# Altium schematic sheet Sheet1.SchDoc
size A2
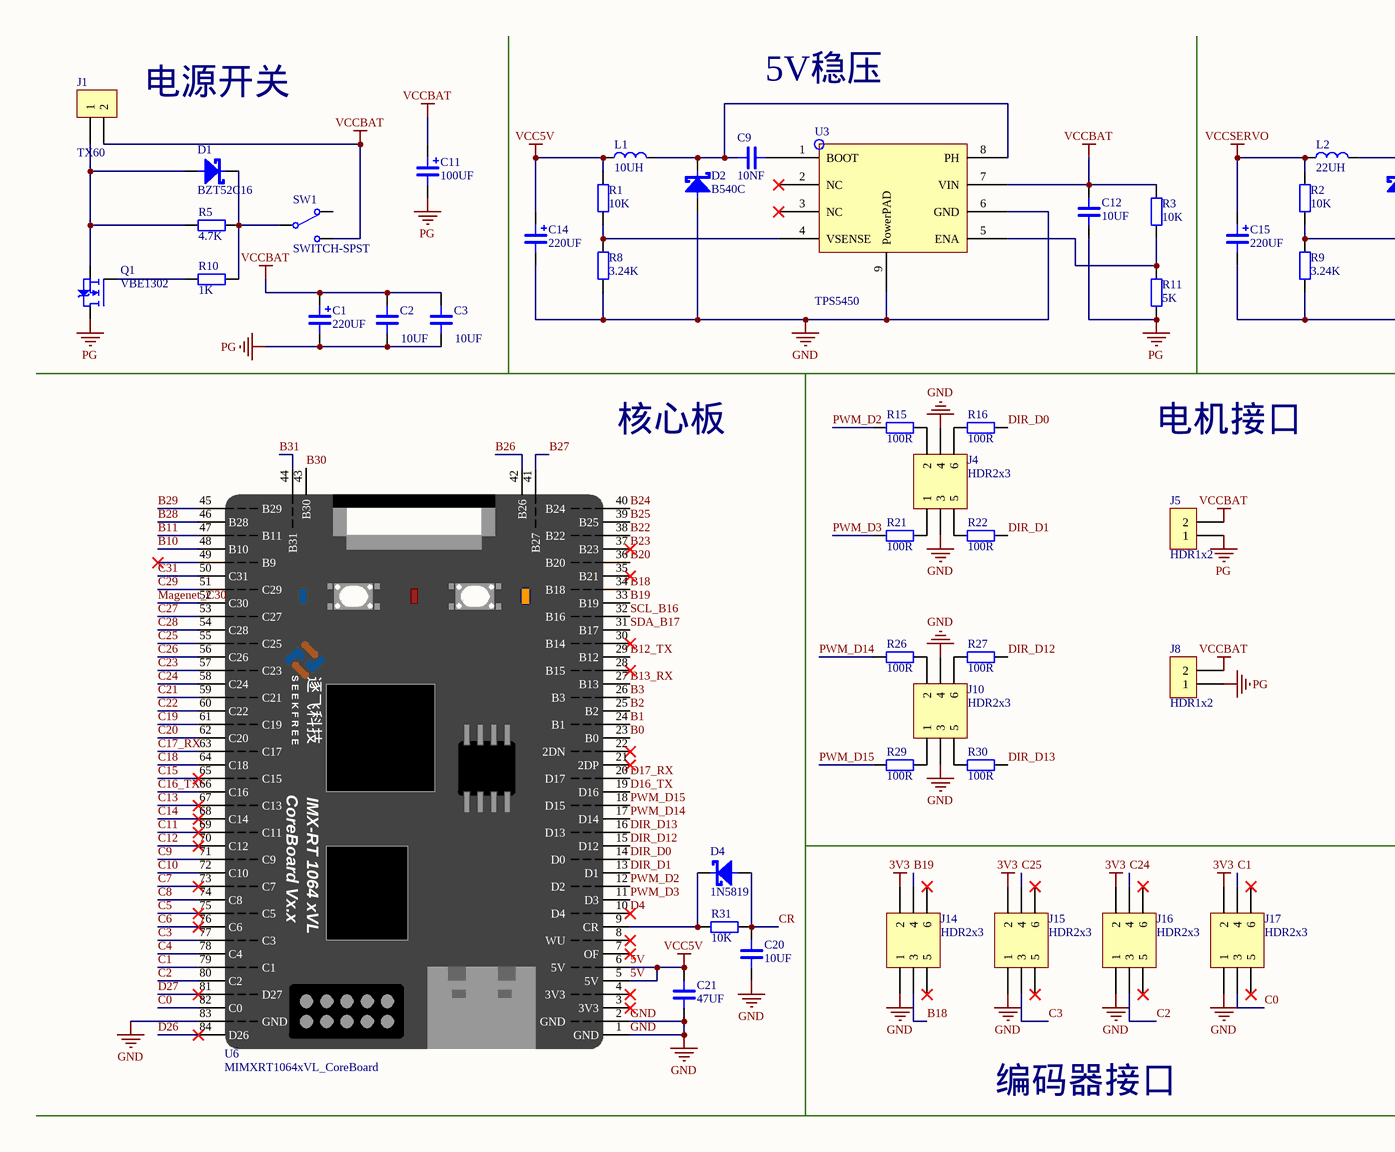
[diagram p0: Sheet1.SchDoc, left]
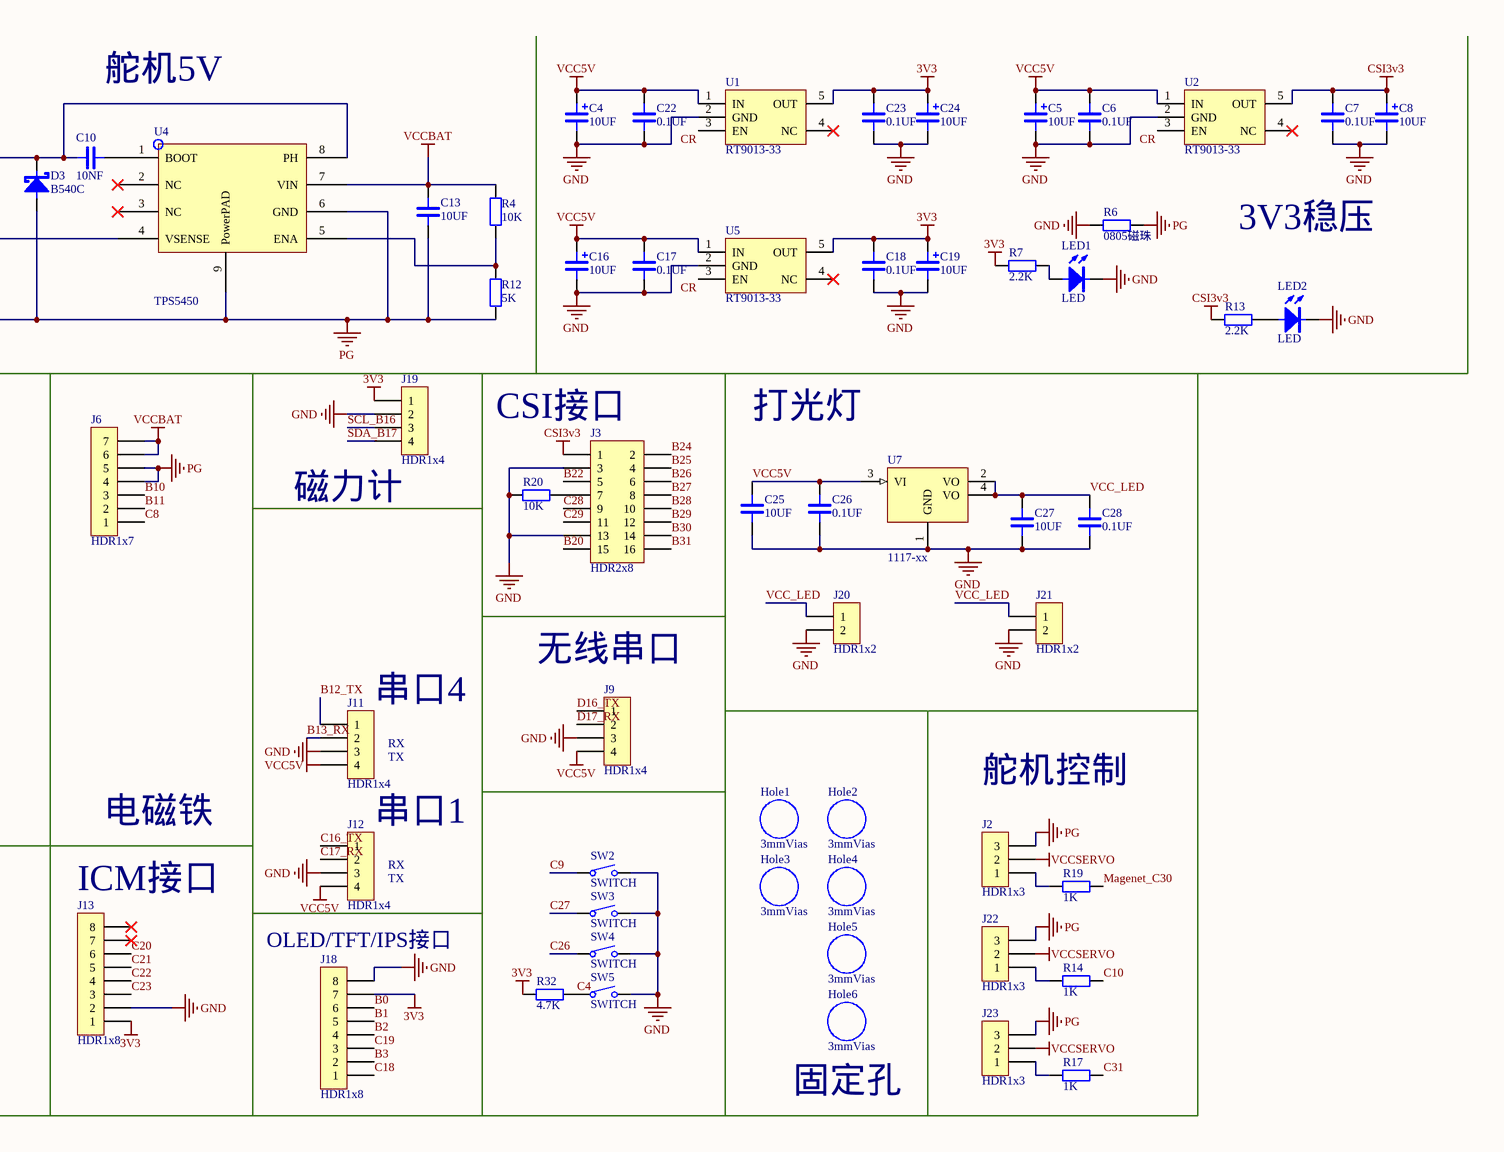
[diagram p1: Sheet1.SchDoc, right]

## Parts
C1  220UF  [DIP-EC3.5X8X11.5]
C2  10UF  [0603]
C3  10UF  [0603]
C4  10UF  [106]
C5  10UF  [106]
C6  0.1UF  [0603]
C7  0.1UF  [0603]
C8  10UF  [106]
C9  10NF  [0603]
C10  10NF  [0603]
C11  100UF  [DIP-EC2.5X6.3X11.2]
C12  10UF  [0603]
C13  10UF  [0603]
C14  220UF  [DIP-EC3.5X8X11.5]
C15  220UF  [DIP-EC3.5X8X11.5]
C16  10UF  [106]
C17  0.1UF  [0603]
C18  0.1UF  [0603]
C19  10UF  [106]
C20  10UF  [0603]
C21  47UF  [1206]
C22  0.1UF  [0603]
C23  0.1UF  [0603]
C24  10UF  [106]
C25  10UF  [0603]
C26  0.1UF  [0603]
C27  10UF  [0603]
C28  0.1UF  [0603]
D1  BZT52C16  [SOD-123]
D2  B540C  [SMC]
D3  B540C  [SMC]
D4  1N5819  [SOD-123]
Hole1  3mmVias  [3mm]
Hole2  3mmVias  [3mm]
Hole3  3mmVias  [3mm]
Hole4  3mmVias  [3mm]
Hole5  3mmVias  [3mm]
Hole6  3mmVias  [3mm]
J1  TX60  [焊盘]
J2  HDR1x3  [PIN-3-2.54-1.0]
J3  HDR2x8  [Fe-HDR2X8/2.54-S]
J4  HDR2x3  [PIN-2x3-2.54-1.0]
J5  HDR1x2  [TX30_焊盘]
J6  HDR1x7  [PIN-7-2.54-1.0]
J8  HDR1x2  [TX30_焊盘]
J9  HDR1x4  [XH4/2.54mm/180]
J10  HDR2x3  [PIN-2x3-2.54-1.0]
J11  HDR1x4  [XH4/2.54mm/180]
J12  HDR1x4  [XH4/2.54mm/180]
J13  HDR1x8  [Fe-HDR1X8/2.54-S]
J14  HDR2x3  [pin_2*3]
J15  HDR2x3  [pin_2*3]
J16  HDR2x3  [pin_2*3]
J17  HDR2x3  [pin_2*3]
J18  HDR1x8  [Fe-HDR1X8/2.54-S]
J19  HDR1x4  [PIN-4-2.54-1.0]
J20  HDR1x2  [PIN-2-2.54-1.0]
J21  HDR1x2  [PIN-2-2.54-1.0]
J22  HDR1x3  [PIN-3-2.54-1.0]
J23  HDR1x3  [PIN-3-2.54-1.0]
L1  10UH  [CDRH73]
L2  22UH  [CDRH73]
LED1  LED  [0603-led]
LED2  LED  [0603-led]
Q1  VBE1302  [TO252]
R1  10K  [0603]
R2  10K  [0603]
R3  10K  [0603]
R4  10K  [0603]
R5  4.7K  [0603]
R6  0805磁珠  [0805]
R7  2.2K  [0603]
R8  3.24K  [0603]
R9  3.24K  [0603]
R10  1K  [0603]
R11  5K  [0603]
R12  5K  [0603]
R13  2.2K  [0603]
R14  1K  [0603]
R15  100R  [0603]
R16  100R  [0603]
R17  1K  [0603]
R19  1K  [0603]
R20  10K  [0603]
R21  100R  [0603]
R22  100R  [0603]
R26  100R  [0603]
R27  100R  [0603]
R29  100R  [0603]
R30  100R  [0603]
R31  10K  [0603]
R32  4.7K  [0603]
SW1  SWITCH-SPST  [ss12d10]
SW2  SWITCH  [按键]
SW3  SWITCH  [按键]
SW4  SWITCH  [按键]
SW5  SWITCH  [按键]
U1  RT9013-33  [RT9013-33]
U2  RT9013-33  [RT9013-33]
U3  TPS5450  [TPS5450]
U4  TPS5450  [TPS5450]
U5  RT9013-33  [RT9013-33]
U6  MIMXRT1064xVL_CoreBoard  [MIMXRT1064xVL_CoreBoard]
U7  1117-xx  [SOT223_4]

## Nets
3V3: C18.1 C19.1 C23.1 C24.1 J13.1 J14.2 J15.2 J16.2 J17.2 J18.7 J19.1 R7.2 R32.1 U1.5(OUT) U5.5(OUT)
5V: C4.1 C5.1 C6.1 C14.1 C16.1 C17.1 C21.2 C22.1 C25.1 C26.1 J9.4 J11.4 J12.4 L1.1 R1.2 U1.1(IN) U2.1(IN) U5.1(IN) U6.5(5V) U6.6(5V) U7.3(VI)  [also labelled VCC5V]
CSI3v3: C7.1 C8.1 J3.1 R13.2 U2.5(OUT)
GND: C4.2 C5.2 C6.2 C7.2 C8.2 C14.2 C16.2 C17.2 C18.2 C19.2 C20.1 C21.1 C22.2 C23.2 C24.2 C25.2 C26.2 C27.2 C28.2 D2.1(A) J3.3 J3.13 J4.3 J4.4 J9.3 J10.3 J10.4 J11.3 J12.3 J13.2 J14.1 J15.1 J16.1 J17.1 J18.8 J19.2 J20.2 J21.2 LED1.2(C) LED2.2(C) R6.2 R8.1 R20.2 SW2.2 SW3.2 SW4.2 SW5.2 U1.2(GND) U2.2(GND) U3.6(GND) U3.9(PowerPAD) U5.2(GND) U6.1(GND) U6.2(GND) U6.83(GND) U7.1(GND)
PG: C1.2 C2.1 C3.1 C11.2 C12.1 C13.1 C15.2 D3.1(A) J2.3 J5.1 J6.4 J6.5 J8.1 J22.3 J23.3 Q1.4(D) R6.1 R9.1 R11.1 R12.1 U4.6(GND) U4.9(PowerPAD)
VCCBAT: C1.1 C2.2 C3.2 C11.1 C12.2 C13.2 J1.2 J5.2 J6.6 J6.7 J8.2 R3.2 R4.2 SW1.3 U3.7(VIN) U4.7(VIN)
VCCSERVO: C15.1 J2.2 J22.2 J23.2 L2.1 R2.2
B0: J18.6 U6.23(B0)
B1: J18.5 U6.24(B1)
B2: J18.4 U6.25(B2)
B3: J18.2 U6.26(B3)
B10: J6.3 U6.48(B10)
B11: J6.2 U6.47(B11)
B12_TX: J11.1 U6.29(B12)
B13_RX: J11.2 U6.27(B13)
B18: J14.3 U6.34(B18)
B19: J14.4 U6.33(B19)
B20: J3.15 U6.36(B20)
B22: J3.5 U6.38(B22)
B23: U6.37(B23)
B24: J3.2 U6.40(B24)
B25: J3.4 U6.39(B25)
B26: J3.6 U6.42(B26)
B27: J3.8 U6.41(B27)
B28: J3.10 U6.46(B28)
B29: J3.12 U6.45(B29)
B30: J3.14 U6.43(B30)
B31: J3.16 U6.44(B31)
C0: J17.3 U6.82(C0)
C1: J17.4 U6.79(C1)
C2: J16.3 U6.80(C2)
C3: J15.3 U6.77(C3)
C4: R32.2 SW5.1 U6.78(C4)
C5: U6.75(C5)
C6: U6.76(C6)
C7: U6.73(C7)
C8: J6.1 U6.74(C8)
C9: SW2.1 U6.71(C9)
C10: R14.2 U6.72(C10)
C11: U6.69(C11)
C12: U6.70(C12)
C13: U6.67(C13)
C14: U6.68(C14)
C15: U6.65(C15)
C16_TX: J12.1 U6.66(C16)
C17_RX: J12.2 U6.63(C17)
C18: J18.1 U6.64(C18)
C19: J18.3 U6.61(C19)
C20: J13.6 U6.62(C20)
C21: J13.5 U6.59(C21)
C22: J13.4 U6.60(C22)
C23: J13.3 U6.57(C23)
C24: J16.4 U6.58(C24)
C25: J15.4 U6.55(C25)
C26: SW4.1 U6.56(C26)
C27: SW3.1 U6.53(C27)
C28: J3.9 U6.54(C28)
C29: J3.11 U6.51(C29)
C31: R17.2 U6.50(C31)
CR: C20.2 D4.1(A) R31.1 U1.3(EN) U2.3(EN) U5.3(EN)
D4: U6.10(D4)
D16_TX: J9.1 U6.19(D16)
D17_RX: J9.2 U6.20(D17)
D26: U6.84(D26)
D27: U6.81(D27)
DIR_D0: R16.1 U6.14(D0)
DIR_D1: R22.1 U6.13(D1)
DIR_D12: R27.1 U6.15(D12)
DIR_D13: R30.1 U6.16(D13)
Magenet_C30: R19.2 U6.52(C30)
PWM_D2: R15.1 U6.12(D2)
PWM_D3: R21.2 U6.11(D3)
PWM_D14: R26.2 U6.17(D14)
PWM_D15: R29.2 U6.18(D15)
SCL_B16: J19.3 U6.32(B16)
SDA_B17: J19.4 U6.31(B17)
VCC_LED: C27.1 C28.1 J20.1 J21.1 U7.2(VO) U7.4(VO)
NetC9_1: C9.1 U3.1(BOOT)
NetC9_2: C9.2 D2.2(C) L1.2 U3.8(PH)
NetC10_1: C10.1 U4.1(BOOT)
NetC10_2: C10.2 D3.2(C) L2.2 U4.8(PH)
NetD1_1: D1.1(A) J1.1 Q1.3(S) R5.1
NetD1_2: D1.2(C) R5.2 R10.2 SW1.2
NetD4_2: D4.2(C) R31.2 U6.9(CR)
NetJ2_1: J2.1 R19.1
NetJ3_7: J3.7 R20.1
NetJ4_1: J4.1 R21.1
NetJ4_2: J4.2 R15.2
NetJ4_5: J4.5 R22.2
NetJ4_6: J4.6 R16.2
NetJ10_1: J10.1 R29.1
NetJ10_2: J10.2 R26.1
NetJ10_5: J10.5 R30.2
NetJ10_6: J10.6 R27.2
NetJ22_1: J22.1 R14.1
NetJ23_1: J23.1 R17.1
NetLED1_1: LED1.1(A) R7.1
NetLED2_1: LED2.1(A) R13.1
NetQ1_1: Q1.1(G) R10.1
NetR1_1: R1.1 R8.2 U3.4(VSENSE)
NetR2_1: R2.1 R9.2 U4.4(VSENSE)
NetR3_1: R3.1 R11.2 U3.5(ENA)
NetR4_1: R4.1 R12.2 U4.5(ENA)

Not connected (* = marked no-connect by the designer): J13 7* 8*; J14 5* 6*; J15 5* 6*; J16 5* 6*; J17 5* 6*; SW1 1; U1 4(NC)*; U2 4(NC)*; U3 2(NC)* 3(NC)*; U4 2(NC)* 3(NC)*; U5 4(NC)*; U6 3(3V3)* 4(3V3)* 7(OF)* 8(WU)* 21(2DP)* 22(2DN)* 28(B15)* 30(B14)* 35(B21)* 49(B9)*

## Notes on the sheet
- 电源开关
- 5V稳压
- 舵机5V
- 3V3稳压
- 核心板
- 电机接口
- (near J3) CSI接口
- 打光灯
- 磁力计
- (near J11) 串口4
- (near J9) 无线串口
- (near J11) RX
- (near J11) TX
- 舵机控制
- 电磁铁
- 串口1
- (near J13) ICM接口
- (near J12) RX
- (near J12) TX
- OLED/TFT/IPS接口
- 编码器接口
- (near Hole6) 固定孔
- (in symbol MIMXRT1064xVL_CoreBoard) S E E K F R E E; 逐飞科技; CoreBoard Vx.x; IMX-RT 1064 xVL

## Library data of the parts
C1 C4 C5 C8 C11 C14-C16 C19 C24 = CAP-TANTALUM: Tantalum Capacitor
C2 C3 C6 C7 C9 C10 C12 C13 C17 C18 C20-C23 C25-C28 = CAP: Capacitor
D1-D4 = SS5x: Schottky Diode
J1 J5 J8 J20 J21 = HDR1x2: Connector
J2 J22 J23 = HDR1x3: Connector
J3 = HDR2x8: Connector
J4 J10 J14-J17 = HDR2x3: Connector
J6 = HDR1x7: Connector
J9 J11 J12 J19 = HDR1x4: Connector
J13 J18 = HDR1x8: Connector
L1 L2 = INDUCTANCE
Q1 = FDB52N20: N-Channel MOSFET
R1-R17 R19-R22 R26 R27 R29-R32 = RES: Resistor
SW1 = SWITCH-SPST: Switch
U1 U2 U5 = RT9013-33: 3.3V 500mA SOT23-5 LDO
U6 = MIMXRT1064xVL_CoreBoard: 逐飞科技i.MX RT1064核心板整体原理，可直接使用
U7 = 1117: Linear Regulator